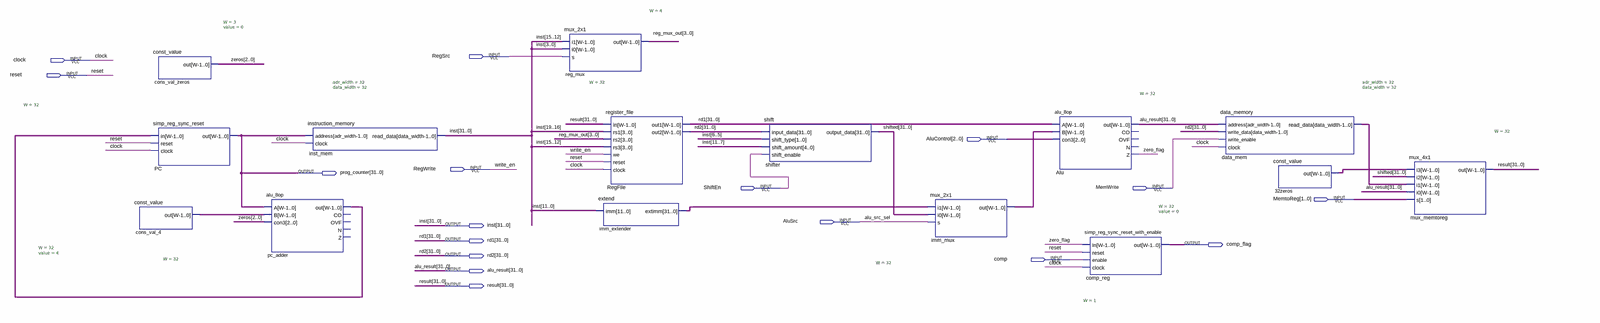
[diagram p0: schematic sheet, whole]
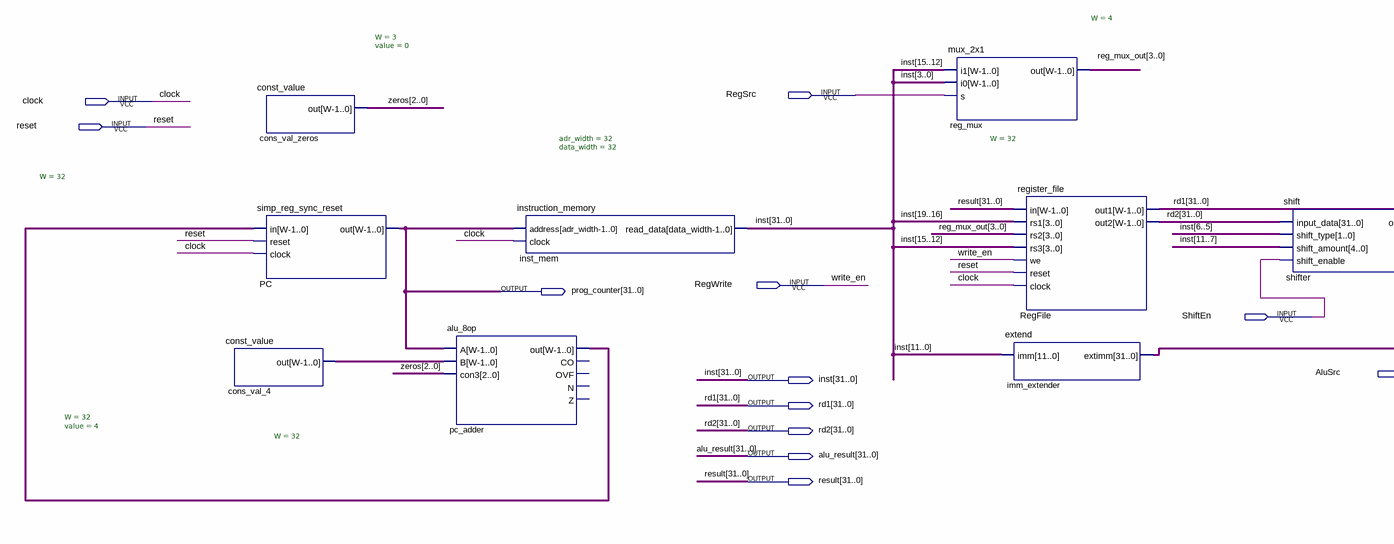
[diagram p1: schematic sheet, left part]
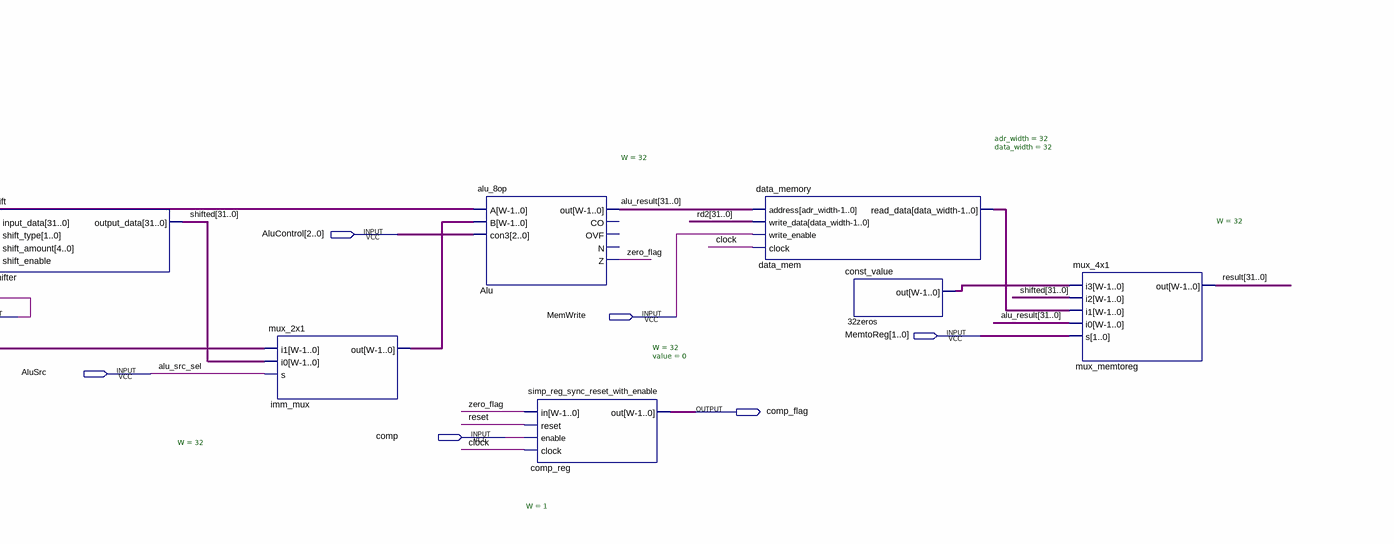
[diagram p2: schematic sheet, right part]
// Quartus schematic datapath.bdf as structural Verilog: 15 symbols, 17 pins
module datapath (
  input  RegSrc,
  input  clock,
  input  reset,
  input  [2:0] AluControl,
  input  RegWrite,
  input  ShiftEn,
  input  MemWrite,
  input  [1:0] MemtoReg,
  input  AluSrc,
  input  comp,
  output [31:0] prog_counter,
  output [31:0] inst,
  output [31:0] rd1,
  output comp_flag,
  output [31:0] rd2,
  output [31:0] alu_result,
  output [31:0] result
);

  wire zero_flag;
  wire [2:0] zeros;
  wire [3:0] reg_mux_out;
  wire [31:0] cons_val_4_out, data_mem_read_data, imm_extender_extimm, imm_mux_out, n32zeros_out,
       pc_adder_out, shifted;

  const_value #(.W(3), .value(0)) cons_val_zeros (.out(zeros));
  simp_reg_sync_reset #(.W(32)) PC (.in(pc_adder_out), .reset(reset), .clock(clock), .out(prog_counter));
  const_value #(.W(32), .value(4)) cons_val_4 (.out(cons_val_4_out));
  alu_8op #(.W(32)) pc_adder (
    .A(prog_counter), .B(cons_val_4_out), .con3(zeros), .out(pc_adder_out));  // open: CO, OVF, N, Z
  instruction_memory #(.adr_width(32), .data_width(32)) inst_mem (
    .address(prog_counter), .clock(clock), .read_data(inst));
  mux_2x1 #(.W(4)) reg_mux (.i1(inst[15:12]), .i0(inst[3:0]), .s(RegSrc), .out(reg_mux_out));
  register_file #(.W(32)) RegFile (
    .in(result), .rs1(inst[19:16]), .rs2(reg_mux_out), .rs3(inst[15:12]), .we(RegWrite), .reset(reset),
    .clock(clock), .out1(rd1), .out2(rd2));
  extend imm_extender (.imm(inst[11:0]), .extimm(imm_extender_extimm));
  shift shifter (
    .input_data(rd2), .shift_type(inst[6:5]), .shift_amount(inst[11:7]), .shift_enable(ShiftEn),
    .output_data(shifted));
  mux_2x1 #(.W(32)) imm_mux (.i1(imm_extender_extimm), .i0(shifted), .s(AluSrc), .out(imm_mux_out));
  alu_8op #(.W(32)) Alu (
    .A(rd1), .B(imm_mux_out), .con3(AluControl), .out(alu_result), .Z(zero_flag));  // open: CO, OVF, N
  simp_reg_sync_reset_with_enable #(.W(1)) comp_reg (
    .in(zero_flag), .reset(reset), .enable(comp), .clock(clock), .out(comp_flag));
  data_memory #(.adr_width(32), .data_width(32)) data_mem (
    .address(alu_result), .write_data(rd2), .write_enable(MemWrite), .clock(clock),
    .read_data(data_mem_read_data));
  const_value #(.W(32), .value(0)) u_32zeros (.out(n32zeros_out));
  mux_4x1 #(.W(32)) mux_memtoreg (
    .i3(n32zeros_out), .i2(shifted), .i1(data_mem_read_data), .i0(alu_result), .s(MemtoReg), .out(result));

  // Other names for the same wires on the sheet: alu_src_sel = AluSrc; write_en = RegWrite
endmodule
